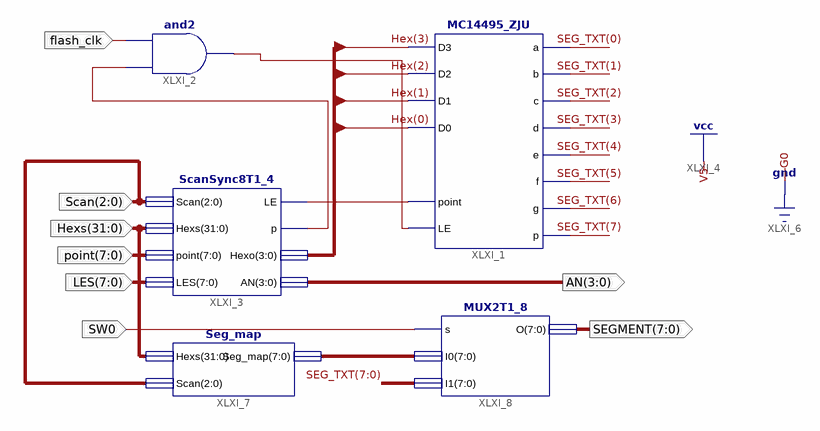
[diagram p0: schematic sheet 1]
// Xilinx ISE schematic Seg7_Dev32.sch (kintex7) as structural Verilog: 5 symbols, 8 ports
module Seg7_Dev32 (
  input  [2:0] Scan,
  input  [31:0] Hexs,
  input  [7:0] point,
  input  [7:0] LES,
  input  flash_clk,
  input  SW0,
  output [3:0] AN,
  output [7:0] SEGMENT
);

  wire XLXN_4, XLXN_6, XLXN_7;
  wire [3:0] Hex;
  wire [7:0] SEG_TXT, XLXN_23;

  MC14495_ZJU XLXI_1 (
    .a(SEG_TXT[0]), .b(SEG_TXT[1]), .c(SEG_TXT[2]), .d(SEG_TXT[3]), .D0(Hex[0]), .D1(Hex[1]), .D2(Hex[2]),
    .D3(Hex[3]), .e(SEG_TXT[4]), .f(SEG_TXT[5]), .g(SEG_TXT[6]), .p(SEG_TXT[7]), .LE(XLXN_7), .point(XLXN_4));
  and XLXI_2 (XLXN_7, XLXN_6, flash_clk);
  ScanSync8T1_4 XLXI_3 (
    .Scan(Scan), .Hexs(Hexs), .point(point), .LES(LES), .LE(XLXN_4), .p(XLXN_6), .Hexo(Hex), .AN(AN));
  Seg_map XLXI_7 (.Hexs(Hexs), .Scan(Scan), .Seg_map(XLXN_23));
  MUX2T1_8 XLXI_8 (.s(SW0), .I0(XLXN_23), .I1(SEG_TXT), .O(SEGMENT));
endmodule
